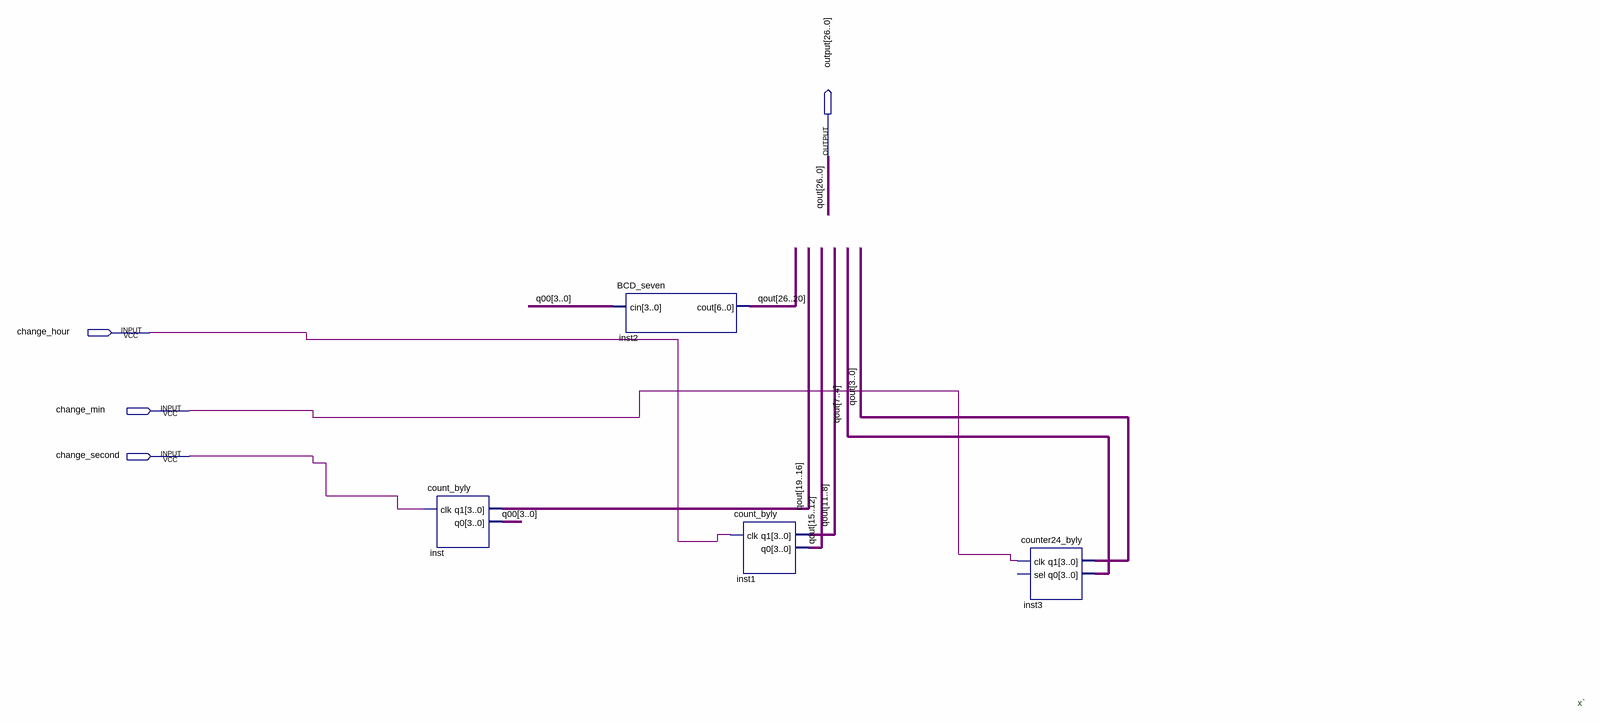
[diagram p0: schematic sheet]
// Quartus schematic alerm.bdf as structural Verilog: 4 symbols, 4 pins
module alerm (
  input  change_hour,
  input  change_min,
  input  change_second,
  output [26:0] \output 
);

  wire [3:0] q00;

  count_byly inst (.clk(change_second), .q1(\output [19:16]), .q0(q00));
  BCD_seven inst2 (.cin(q00), .cout(\output [26:20]));
  count_byly inst1 (.clk(change_hour), .q1(\output [11:8]), .q0(\output [15:12]));
  counter24_byly inst3 (.clk(change_min), .q1(\output [3:0]), .q0(\output [7:4]));  // open: sel

  // Other names for the same wires on the sheet: qout[26:0] = \output 

  // Notes on the sheet:
  //   x`
endmodule
